# EAGLE design quadcopter (EAGLE 8.2.0)
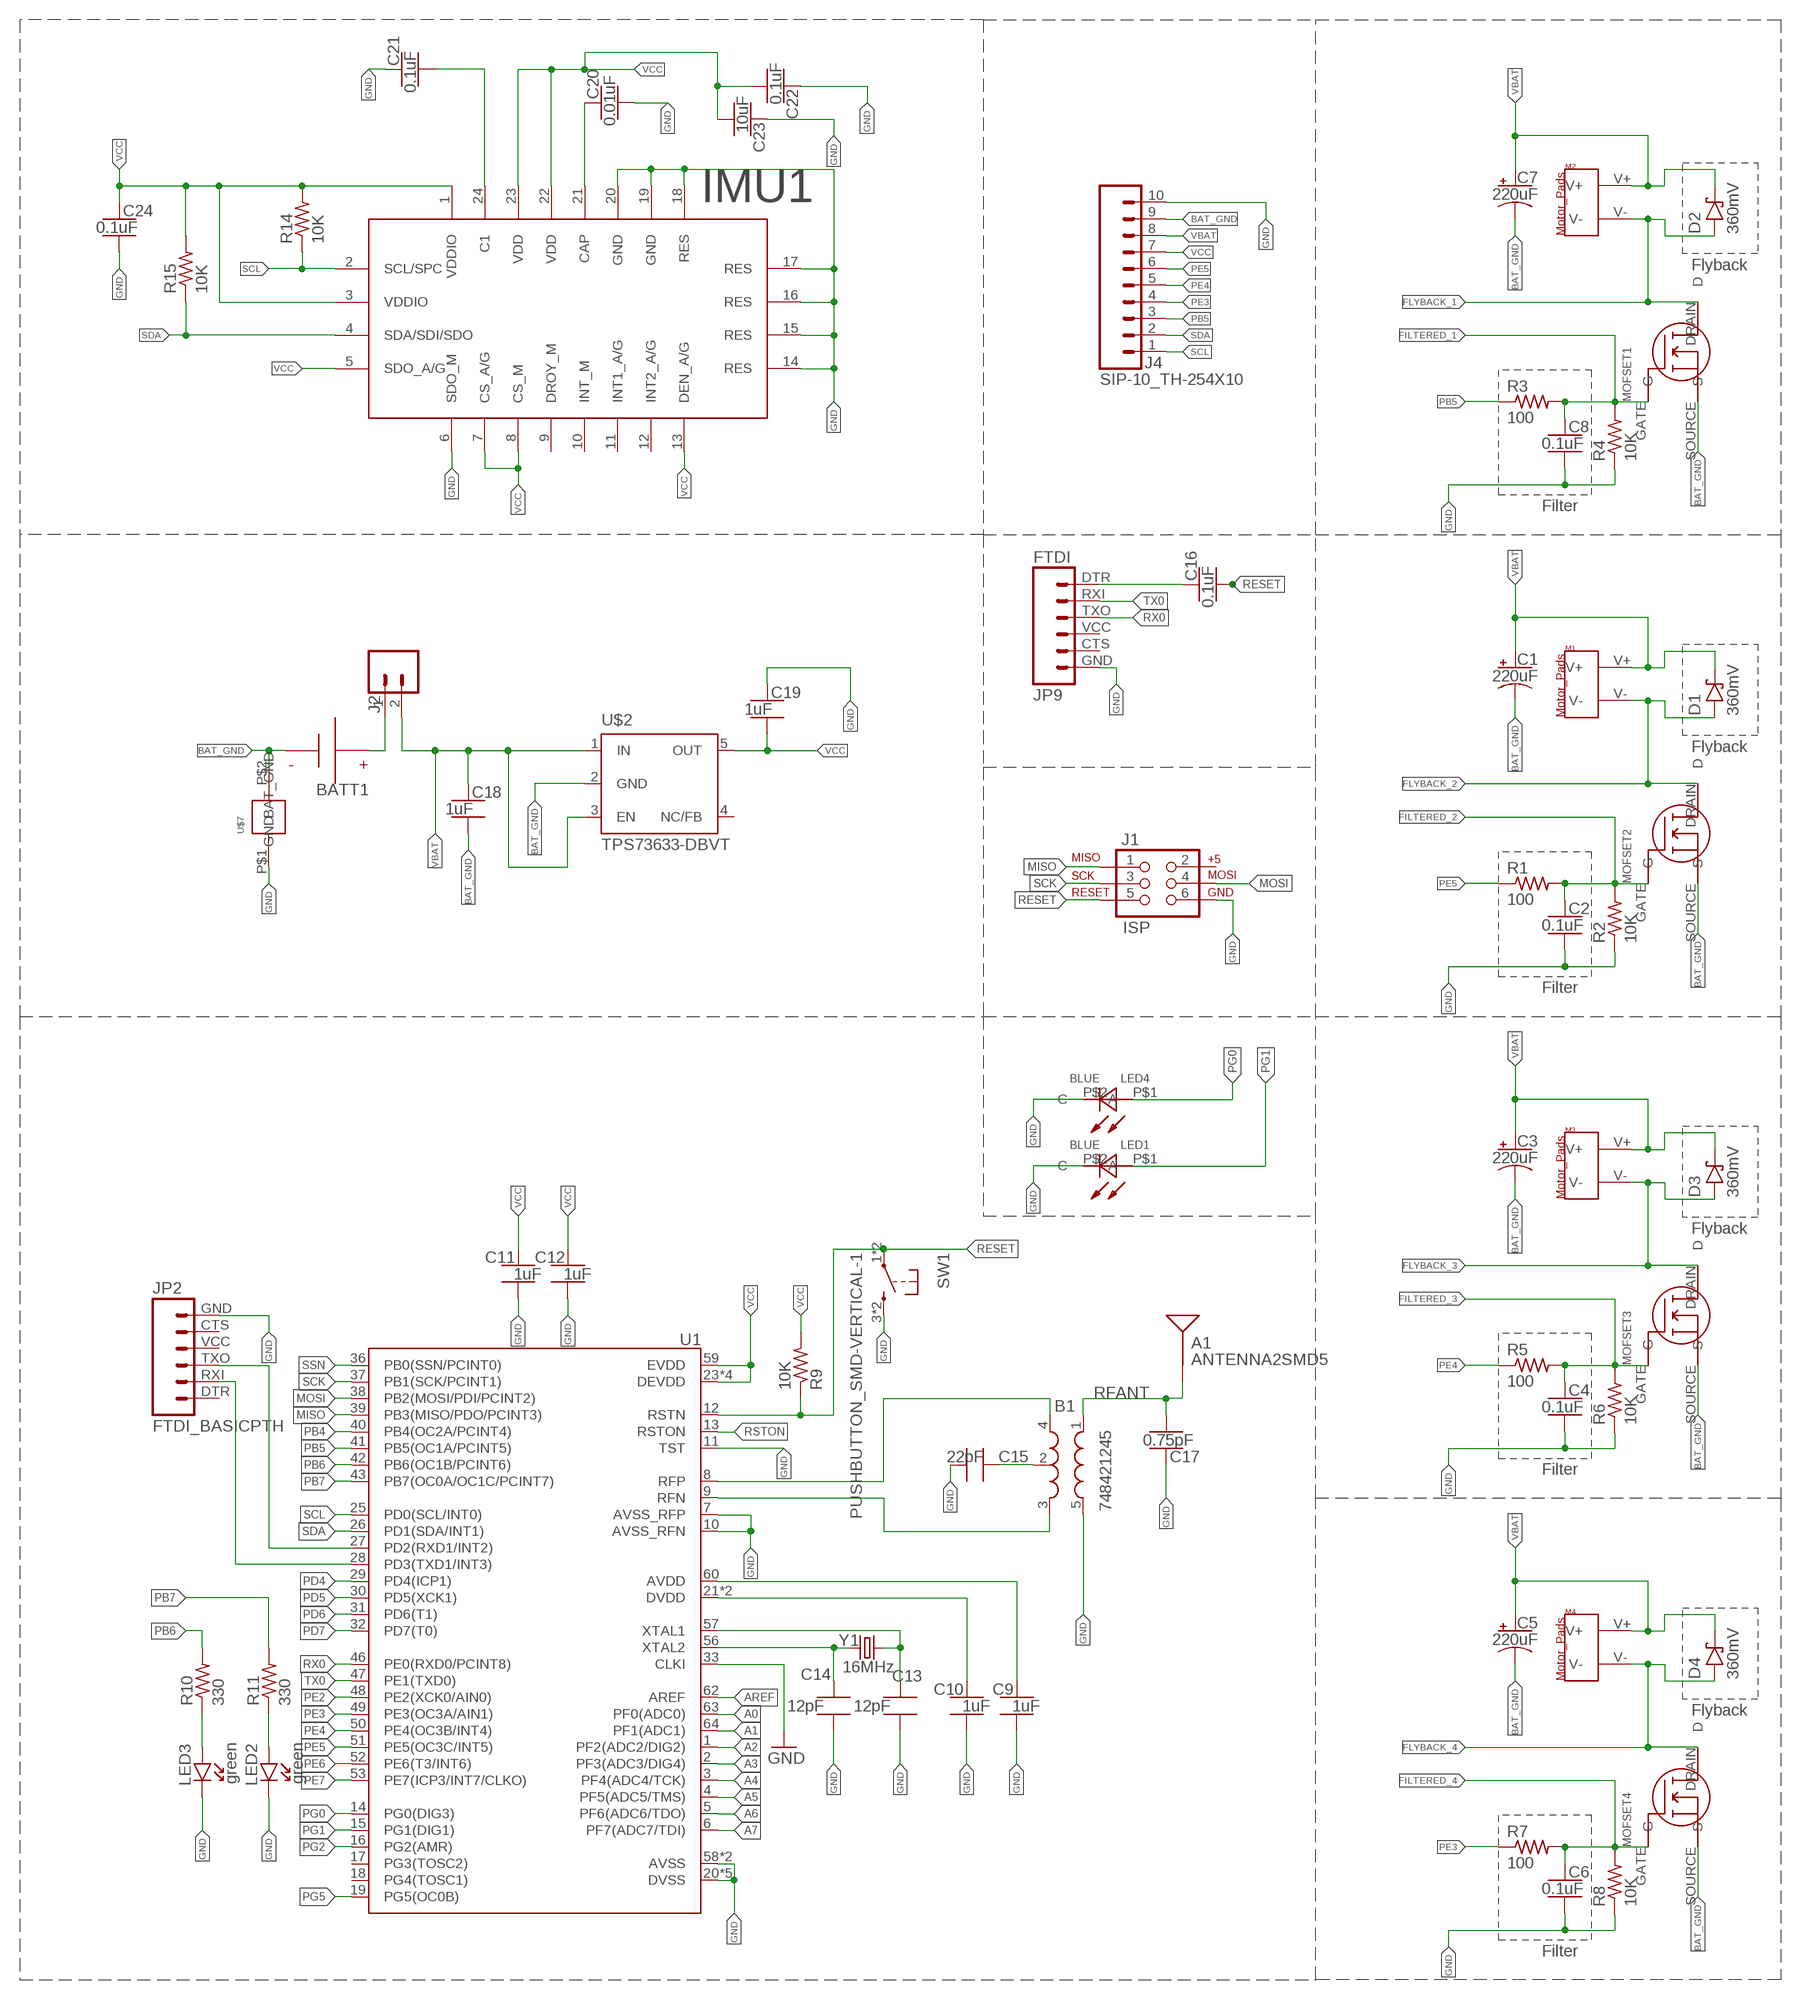
[diagram p0: schematic, sheet 1]

## Parts
A1  ANTENNA2SMD5  [ANTENNA-CHIP5]
B1  748421245  BALUN0805  [BALUN]
BATT1  BATTERY-HUBSAN-W/HOLDER  [BATTERY-W/HOLDER-380MAH-HUBSAN]
C1  220uF  CAPACITOR-POL_SMD-7043-D_TANTALUM-220UF  [CAPMP7343X310_HS]
C2  0.1uF  CAPACITOR-NP_SMD-2012-0805_CERAMIC-0.1UF  [CAPC2012X140_HS]
C3  220uF  CAPACITOR-POL_SMD-7043-D_TANTALUM-220UF  [CAPMP7343X310_HS]
C4  0.1uF  CAPACITOR-NP_SMD-2012-0805_CERAMIC-0.1UF  [CAPC2012X140_HS]
C5  220uF  CAPACITOR-POL_SMD-7043-D_TANTALUM-220UF  [CAPMP7343X310_HS]
C6  0.1uF  CAPACITOR-NP_SMD-2012-0805_CERAMIC-0.1UF  [CAPC2012X140_HS]
C7  220uF  CAPACITOR-POL_SMD-7043-D_TANTALUM-220UF  [CAPMP7343X310_HS]
C8  0.1uF  CAPACITOR-NP_SMD-2012-0805_CERAMIC-0.1UF  [CAPC2012X140_HS]
C9  1uF  CAPACITOR-NP_SMD-2012-0805_CERAMIC-1UF  [CAPC2012X140_HS]
C10  1uF  CAPACITOR-NP_SMD-2012-0805_CERAMIC-1UF  [CAPC2012X140_HS]
C11  1uF  CAPACITOR-NP_SMD-2012-0805_CERAMIC-1UF  [CAPC2012X140_HS]
C12  1uF  CAPACITOR-NP_SMD-2012-0805_CERAMIC-1UF  [CAPC2012X140_HS]
C13  12pF  CAPACITOR-NP_SMD-2012-0805_CERAMIC-12PF  [CAPC2012X140_HS]
C14  12pF  CAPACITOR-NP_SMD-2012-0805_CERAMIC-12PF  [CAPC2012X140_HS]
C15  22pF  CAPACITOR-NP_SMD-2012-0805_CERAMIC-22PF  [CAPC2012X140_HS]
C16  0.1uF  CAPACITOR-NP_SMD-2012-0805_CERAMIC-0.1UF  [CAPC2012X140_HS]
C17  0.75pF  CAPACITOR-NP_SMD-2012-0805_CERAMIC-0.75PF  [CAPC2012X140_HS]
C18  1uF  CAPACITOR-NP_SMD-2012-0805_CERAMIC-1UF  [CAPC2012X140_HS]
C19  1uF  CAPACITOR-NP_SMD-2012-0805_CERAMIC-1UF  [CAPC2012X140_HS]
C20  0.01uF  CAPACITOR-NP_SMD-2012-0805_CERAMIC-0.01UF  [CAPC2012X140_HS]
C21  0.1uF  CAPACITOR-NP_SMD-2012-0805_CERAMIC-0.1UF  [CAPC2012X140_HS]
C22  0.1uF  CAPACITOR-NP_SMD-2012-0805_CERAMIC-0.1UF  [CAPC2012X140_HS]
C23  10uF  CAPACITOR-NP_SMD-2012-0805_CERAMIC-10UF  [CAPC2012X140_HS]
C24  0.1uF  CAPACITOR-NP_SMD-2012-0805_CERAMIC-0.1UF  [CAPC2012X140_HS]
D1  360mV  DIODE-SCHOTTKY_SMD-SOD123-360MV  [SOD3716X135_HS]
D2  360mV  DIODE-SCHOTTKY_SMD-SOD123-360MV  [SOD3716X135_HS]
D3  360mV  DIODE-SCHOTTKY_SMD-SOD123-360MV  [SOD3716X135_HS]
D4  360mV  DIODE-SCHOTTKY_SMD-SOD123-360MV  [SOD3716X135_HS]
IMU1  9_AXIS_IMU  [9_AXIS_IMU]
J1  ISP  AVR_SPI_PRG_6NS  [2X3-NS]
J2  MALE_HEADER_2POS-2X1-0.1IN  [MALE_HEADER_2X1_0.1IN]
J4  SIP-10_TH-254X10  [HDRV10W63P254_10X1_2540X254H838_HS]
JP2  FTDI_BASICPTH  [FTDI_BASIC]
JP9  FTDI  FTDI_BASICPTH  [FTDI_BASIC]
LED1  BLUE  LTST-C193TBKT-5ADISCRETE_LED  [CUT_TAPE]
LED2  green  DIODE-LED_SMD-2012-0805-GREEN  [LEDSC125X200X120-2_HS]
LED3  green  DIODE-LED_SMD-2012-0805-GREEN  [LEDSC125X200X120-2_HS]
LED4  BLUE  LTST-C193TBKT-5ADISCRETE_LED  [CUT_TAPE]
M1  MOTOR_PADS  [MOTOR_PADS]
M2  MOTOR_PADS  [MOTOR_PADS]
M3  MOTOR_PADS  [MOTOR_PADS]
M4  MOTOR_PADS  [MOTOR_PADS]
MOFSET1  SI2302CDS_N_MOFSETSI2302CDS  [N-CHANNEL_MOSFET]
MOFSET2  SI2302CDS_N_MOFSETSI2302CDS  [N-CHANNEL_MOSFET]
MOFSET3  SI2302CDS_N_MOFSETSI2302CDS  [N-CHANNEL_MOSFET]
MOFSET4  SI2302CDS_N_MOFSETSI2302CDS  [N-CHANNEL_MOSFET]
R1  100  RESISTOR_SMD-2012-0805-100  [RESC2012X60_HS]
R2  10K  RESISTOR_SMD-2012-0805-10K  [RESC2012X60_HS]
R3  100  RESISTOR_SMD-2012-0805-100  [RESC2012X60_HS]
R4  10K  RESISTOR_SMD-2012-0805-10K  [RESC2012X60_HS]
R5  100  RESISTOR_SMD-2012-0805-100  [RESC2012X60_HS]
R6  10K  RESISTOR_SMD-2012-0805-10K  [RESC2012X60_HS]
R7  100  RESISTOR_SMD-2012-0805-100  [RESC2012X60_HS]
R8  10K  RESISTOR_SMD-2012-0805-10K  [RESC2012X60_HS]
R9  10K  RESISTOR_SMD-2012-0805-10K  [RESC2012X60_HS]
R10  330  RESISTOR_SMD-2012-0805-330  [RESC2012X60_HS]
R11  330  RESISTOR_SMD-2012-0805-330  [RESC2012X60_HS]
R14  10K  RESISTOR_SMD-2012-0805-10K  [RESC2012X60_HS]
R15  10K  RESISTOR_SMD-2012-0805-10K  [RESC2012X60_HS]
SW1  PUSHBUTTON_SMD-VERTICAL-1  [TE_FSM8JSMA_HS]
U1  ATMEGA128RFA1  [QFN-64]
U$2  TPS73633-DBVT  [SOT23-DBV]
U$7  NET_BRIDGE  [NET_BRIDGE]
Y1  16MHz  CRYSTAL5X3  [CRYSTAL-SMD-5X3]

## Nets
A0: U1.63(PF0(ADC0))
A1: U1.64(PF1(ADC1))
A2: U1.1(PF2(ADC2/DIG2))
A3: U1.2(PF3(ADC3/DIG4))
A4: U1.3(PF4(ADC4/TCK))
A5: U1.4(PF5(ADC5/TMS))
A6: U1.5(PF6(ADC6/TDO))
A7: U1.6(PF7(ADC7/TDI))
AREF: U1.62(AREF)
AVDD: C9.1 U1.60(AVDD)
BAT_GND [HIGHCURRENT]: BATT1.-(N) C1.2(-) C3.2(-) C5.2(-) C7.2(-) C18.2 J4.9 MOFSET1.SOURCE(S) MOFSET2.SOURCE(S) MOFSET3.SOURCE(S) MOFSET4.SOURCE(S) U$2.2(GND) U$7.P$2(GND)
DTR: C16.1 JP9.DTR
DVDD: C10.1 U1.21(DVDD) U1.22(DVDD)
FILTERED_1 [HIGHCURRENT]: C8.1 MOFSET1.GATE(G) R3.2 R4.2
FILTERED_2 [HIGHCURRENT]: C2.1 MOFSET2.GATE(G) R1.2 R2.2
FILTERED_3 [HIGHCURRENT]: C4.1 MOFSET3.GATE(G) R5.2 R6.2
FILTERED_4 [HIGHCURRENT]: C6.1 MOFSET4.GATE(G) R7.2 R8.2
FLYBACK_1 [HIGHCURRENT]: D2.A M2.V- MOFSET1.DRAIN(D)
FLYBACK_2 [HIGHCURRENT]: D1.A M1.V- MOFSET2.DRAIN(D)
FLYBACK_3 [HIGHCURRENT]: D3.A M3.V- MOFSET3.DRAIN(D)
FLYBACK_4 [HIGHCURRENT]: D4.A M4.V- MOFSET4.DRAIN(D)
GND: B1.5(GND) C2.2 C4.2 C6.2 C8.2 C9.2 C10.2 C11.2 C12.2 C13.2 C14.2 C15.2 C17.1 C19.1 C20.2 C21.1 C22.1 C23.1 C24.2 IMU1.6(SDO_M) IMU1.14(RES) IMU1.15(RES) IMU1.16(RES) IMU1.17(RES) IMU1.18(RES) IMU1.19(GND) IMU1.20(GND) J1.6 J4.10 JP2.GND JP9.GND LED1.P$2(C) LED2.C LED3.C LED4.P$2(C) R2.1 R4.1 R6.1 R8.1 SW1.3 SW1.4 U1.7(AVSS_RFP) U1.10(AVSS_RFN) U1.11(TST) U1.20(DVSS) U1.24(DVSS) U1.33(CLKI) U1.35(DVSS) U1.45(DVSS) U1.55(DVSS) U1.58(AVSS) U1.61(AVSS) U$7.P$1(BAT_GND)
MISO: J1.1 U1.39(PB3(MISO/PDO/PCINT3))
MOSI: J1.4 U1.38(PB2(MOSI/PDI/PCINT2))
N$1: C20.1 IMU1.21(CAP)
N$2: C21.2 IMU1.24(C1)
N$4: JP2.RXI U1.28(PD3(TXD1/INT3))
N$5: JP2.TXO U1.27(PD2(RXD1/INT2))
N$7 [HIGHCURRENT]: BATT1.+(P) J2.1
N$13: C13.1 U1.57(XTAL1) Y1.3
N$14: C14.1 U1.56(XTAL2) Y1.1
N$15: B1.2(GND) C15.1
N$16: LED3.A R10.1
N$17: LED2.A R11.1
N$18: B1.4(OUT1) U1.8(RFP)
N$19: B1.3(OUT2) U1.9(RFN)
PB4: U1.40(PB4(OC2A/PCINT4))
PB5: J4.3 R3.1 U1.41(PB5(OC1A/PCINT5))
PB6: R10.2 U1.42(PB6(OC1B/PCINT6))
PB7: R11.2 U1.43(PB7(OC0A/OC1C/PCINT7))
PD4: U1.29(PD4(ICP1))
PD5: U1.30(PD5(XCK1))
PD6: U1.31(PD6(T1))
PD7: U1.32(PD7(T0))
PE2: U1.48(PE2(XCK0/AIN0))
PE3: J4.4 R7.1 U1.49(PE3(OC3A/AIN1))
PE4: J4.5 R5.1 U1.50(PE4(OC3B/INT4))
PE5: J4.6 R1.1 U1.51(PE5(OC3C/INT5))
PE6: U1.52(PE6(T3/INT6))
PE7: U1.53(PE7(ICP3/INT7/CLKO))
PG0: LED4.P$1(A) U1.14(PG0(DIG3))
PG1: LED1.P$1(A) U1.15(PG1(DIG1))
PG2: U1.16(PG2(AMR))
PG5: U1.19(PG5(OC0B))
RESET: C16.2 J1.5 R9.1 SW1.1 SW1.2 U1.12(RSTN)
RFANT [RFSIG]: A1.FEED(SIGNAL) B1.1(IN) C17.2
RSTON: U1.13(RSTON)
RX0: JP9.TXO U1.46(PE0(RXD0/PCINT8))
SCK: J1.3 U1.37(PB1(SCK/PCINT1))
SCL: IMU1.2(SCL/SPC) J4.1 R14.1 U1.25(PD0(SCL/INT0))
SDA: IMU1.4(SDA/SDI/SDO) J4.2 R15.1 U1.26(PD1(SDA/INT1))
SSN: U1.36(PB0(SSN/PCINT0))
TX0: JP9.RXI U1.47(PE1(TXD0))
VBAT [HIGHCURRENT]: C1.1(+) C3.1(+) C5.1(+) C7.1(+) C18.1 D1.C D2.C D3.C D4.C J2.2 J4.8 M1.V+ M2.V+ M3.V+ M4.V+ U$2.1(IN) U$2.3(EN)
VCC: C11.1 C12.1 C19.2 C22.2 C23.2 C24.1 IMU1.1(VDDIO) IMU1.3(VDDIO) IMU1.5(SDO_A/G) IMU1.7(CS_A/G) IMU1.8(CS_M) IMU1.13(DEN_A/G) IMU1.22(VDD) IMU1.23(VDD) J4.7 R9.2 R14.2 R15.2 U1.23(DEVDD) U1.34(DEVDD) U1.44(DEVDD) U1.54(DEVDD) U1.59(EVDD) U$2.5(OUT)
Unconnected: IMU1.9(DROY_M) IMU1.10(INT_M) IMU1.11(INT1_A/G) IMU1.12(INT2_A/G) J1.2 JP2.CTS JP2.DTR JP2.VCC JP9.CTS JP9.VCC U1.17(PG3(TOSC2)) U1.18(PG4(TOSC1)) U$2.4(NC/FB)

## Notes on the sheet
- Flyback
- Filter
- Flyback
- Filter
- Flyback
- Filter
- Flyback
- Filter

## Library data of the parts
A1 = quadparts_prebuilt:ANTENNA2: Chip antenna Single endded antenna. Common with smaller chip antennas. CHIP4 package is the GPS Chip Antenna SKU: GPS-08418. CHIP5 package is 2.4GHz chip antenna SKU: WRL-00144.; DATASHEET: http://www.linxtechnologies.com/resources/data-guides/ant-xxx-chp-x.pdf; DIST: Digikey; DISTPN: ANT-2.45-CHPCT-ND; MFR: Linx Technologies Inc.; MPN: ANT-2.45-CHP-T; PRICE: 3.16
B1 = quadparts_prebuilt:BALUN: 0805 footprint balun- Ember 351/357; CREATOR: PROF; DATASHEET: http://katalog.we-online.de/pbs/datasheet/748421245.pdf; DIST: Digikey; DISTPN: 732-2230-6-ND; MFR: Wurth Electronics Inc; MPN: 748421245; PRICE: 2.63
BATT1 = quadparts_prebuilt:BATTERY; CREATOR: Swanson; DIST: AMAZON; DISTPN: http://www.amazon.com/dp/B00RROB6Q4?smid=AMNTPWSAB5H0S; MFR: HUBSAN; MPN: X4-H107C-8-in-1
C1 C3 C5 C7 = quadparts_prebuilt:CAPACITOR-POL_: Polarized capacitor; DIST: Digikey; DISTPN: 478-8912-1-ND; MFR: AVX Corporation; MPN: TAJD227K006RNJ
C2 C4 C6 C8 C16 C21 C22 C24 = quadparts_prebuilt:CAPACITOR-NP_: Nonpolarized capacitor; CREATOR: PROF; DIST: Digikey; DISTPN: 490-1666-1-ND; MFR: Murata Electronics North America; MPN: GRM21BR71H104KA01L
C9-C12 C18 C19 = quadparts_prebuilt:CAPACITOR-NP_: Nonpolarized capacitor; DIST: Digikey; DISTPN: 490-4736-1-ND; MFR: Murata Electronics North America; MPN: GRM21BR71H105KA12L
C13 C14 = quadparts_prebuilt:CAPACITOR-NP_: Nonpolarized capacitor; DIST: Digikey; DISTPN: 490-5531-1-ND; MFR: Murata Electronics North America; MPN: GRM21A5C2E120JW01D
C15 = quadparts_prebuilt:CAPACITOR-NP_: Nonpolarized capacitor; CREATOR: PROF; DIST: Digikey; DISTPN: 490-5534-1-ND; MFR: Murata Electronics North America; MPN: GRM21A5C2E220JW01D
C17 = quadparts_prebuilt:CAPACITOR-NP_: Nonpolarized capacitor; DIST: Digikey; DISTPN: 490-3585-1-ND; MFR: Murata Electronics North America; MPN: GQM2195C2AR75CB01D
C20 = quadparts_prebuilt:CAPACITOR-NP_: Nonpolarized capacitor; CREATOR: PROF; DIST: Digikey; DISTPN: 490-8295-1-ND; MFR: Murata Electronics North America; MPN: GRM2195C1H103FA01D
C23 = quadparts_prebuilt:CAPACITOR-NP_: Nonpolarized capacitor; DIST: Digikey; DISTPN: 490-5523-1-ND; MFR: Murata Electronics North America; MPN: GRM21BR61E106KA73L
D1-D4 = quadparts_prebuilt:DIODE-SCHOTTKY_: Schottky diode; DIST: Digikey; DISTPN: CRS08QMCT-ND; MFR: Toshiba Semiconductor and Storage; MPN: CRS08(TE85L,Q,M)
IMU1 = quadparts_yupei:9_AXIS_IMU; CREATOR: Yupei; DIST: Digikey; DISTPN: 497-14946-1-ND; MFR: STMicroelectronics; MPN: LSM9DS1TR; REVIEWER: Group 9
J1 = quadparts_prebuilt:AVR_SPI_PRG_6: AVR ISP 6 Pin This is the reduced ISP connector for AVR programming. Common on Arduino. This footprint will take up less PCB space and can be used with a 10-pin to 6-pin adapter such as SKU: BOB-08508; CREATOR: PROF; DATASHEET: http://portal.fciconnect.com/Comergent//fci/drawing/67996.pdf; DIST: Digikey; DISTPN: 609-3234-ND; MFR: Amphenol FCI; MPN: 67997-206HLF; PRICE: 0.31
J2 = quadparts:MALE_HEADER_2POS: 2 pin single inline pin header, socket, or connector; CREATOR: SWANSON; DIST: Digikey; DISTPN: 3M9447-ND; MFR: 3M; MPN: 961102-6404-AR; REVIEWER: Group 9
J4 = quadparts_prebuilt:SIP-10_: 10 pin single inline pin header, socket, or connector; DATASHEET: http://portal.fciconnect.com/Comergent//fci/drawing/68000.pdf; DIST: Digikey; DISTPN: 609-3250-ND; MFR: Amphenol FCI; MPN: 68000-110HLF; PRICE: 0.55
JP2 JP9 = quadparts_prebuilt:FTDI_BASIC: FTDI Basic header with labels; DATASHEET: http://portal.fciconnect.com/Comergent//fci/drawing/68015.pdf; DIST: Digikey; DISTPN: 609-3327-ND; MFR: Amphenol FCI; MPN: 68016-406HLF; PRICE: 0.33
LED1 LED4 = LEDs:LTST-C193TBKT-5A: Discrete LED indication with blue color.; CREATOR: Yueqi Wang; DIST: Digikey; DISTPN: 160-1827-1-ND; MFR: Lite-On Inc; MPN: LTST-C193TBKT-5A; REVIEWER: Group 9
LED2 LED3 = quadparts_prebuilt:DIODE-LED_: Light emitting diode; DIST: Digikey; DISTPN: 160-1179-1-ND; MFR: Lite-On Inc; MPN: LTST-C170GKT
M1-M4 = quadparts_prebuilt:MOTOR_PADS; CREATOR: PROF; DIST: NA; DISTPN: NA; MFR: NA; MPN: NA
MOFSET1-MOFSET4 = quadparts:SI2302CDS_N_MOFSET: N-Channel 20 V (D-S) MOSFET Si2302CDS by Vishay Siliconix. Features: 1. TrenchFET Power MOSFET. 2. Material categorization: For definitions of compliance please see www.vishay.com/doc?99912 Applications: 1. Load Switching for Portable Devices 2. DC/AC Converter; CREATOR: YUEQI WANG; DIST: Digikey; DISTPN: SI2302CDS-T1-E3CT-ND; MFR: Vishay Siliconix; MPN: SI2302CDS-T1-E3; REVIEWER: Group 9
R1 R3 R5 R7 = quadparts_prebuilt:RESISTOR_: Resistor; CREATOR: PROF; DIST: Digikey; DISTPN: 311-100ARCT-ND; MFR: Yageo; MPN: RC0805JR-07100RL
R2 R4 R6 R8 R9 R14 R15 = quadparts_prebuilt:RESISTOR_: Resistor; CREATOR: PROF; DIST: Digikey; DISTPN: 311-10KARCT-ND; MFR: Yageo; MPN: RC0805JR-0710KL
R10 R11 = quadparts_prebuilt:RESISTOR_: Resistor; CREATOR: PROF; DIST: Digikey; DISTPN: 311-330ARCT-ND; MFR: Yageo; MPN: RC0805JR-07330RL
SW1 = quadparts_prebuilt:PUSHBUTTON_: Pushbutton with 2 pins shorting 1 to 2 and two extra mounting pins 3 & 4; DIST: Digikey; DISTPN: 450-1129-ND; MFR: TE Connectivity Alcoswitch Switches; MPN: FSM4JSMA
U1 = quadparts_prebuilt:ATMEGA128RFA1: ATmega128RFA1 8-bit AVR Microcontroller with Low Power 2.4GHz Transceiver for ZigBee and IEEE 802.15.4; CREATOR: Swanson; DATASHEET: http://www.atmel.com/Images/Atmel-8266-MCU_Wireless-ATmega128RFA1_Datasheet.pdf; DIST: Digikey; DISTPN: ATMEGA128RFA1-ZUR00DKR-ND; MFR: Atmel; MPN: ATMEGA128RFA1-ZUR00; PRICE: 10.21
U$2 = quadparts_prebuilt:TPS73633-DBVT; DATASHEET: http://www.ti.com/lit/ds/symlink/lp3985.pdf; DIST: Digikey; DISTPN: LP3985IM5X-3.0/NOPBCT-ND; MFR: Texas Instruments; MPN: LP3985IM5X-3.0/NOPB; PRICE: 0.59
U$7 = quadparts_prebuilt:NET_BRIDGE
Y1 = quadparts_prebuilt:CRYSTAL: Various standard crystals. Proven footprints.; DATASHEET: http://www.abracon.com/Resonators/abm3b.pdf; DIST: Digikey; DISTPN: 535-9122-1-ND; MFR: Abracon LLC; MPN: ABM3B-16.000MHZ-B2-T; PRICE: 0.68; PROD_ID: XTAL-08218

## Net classes
1 RFSIG: width 0.457 mm
2 HIGHCURRENT: width 0.457 mm

## Board
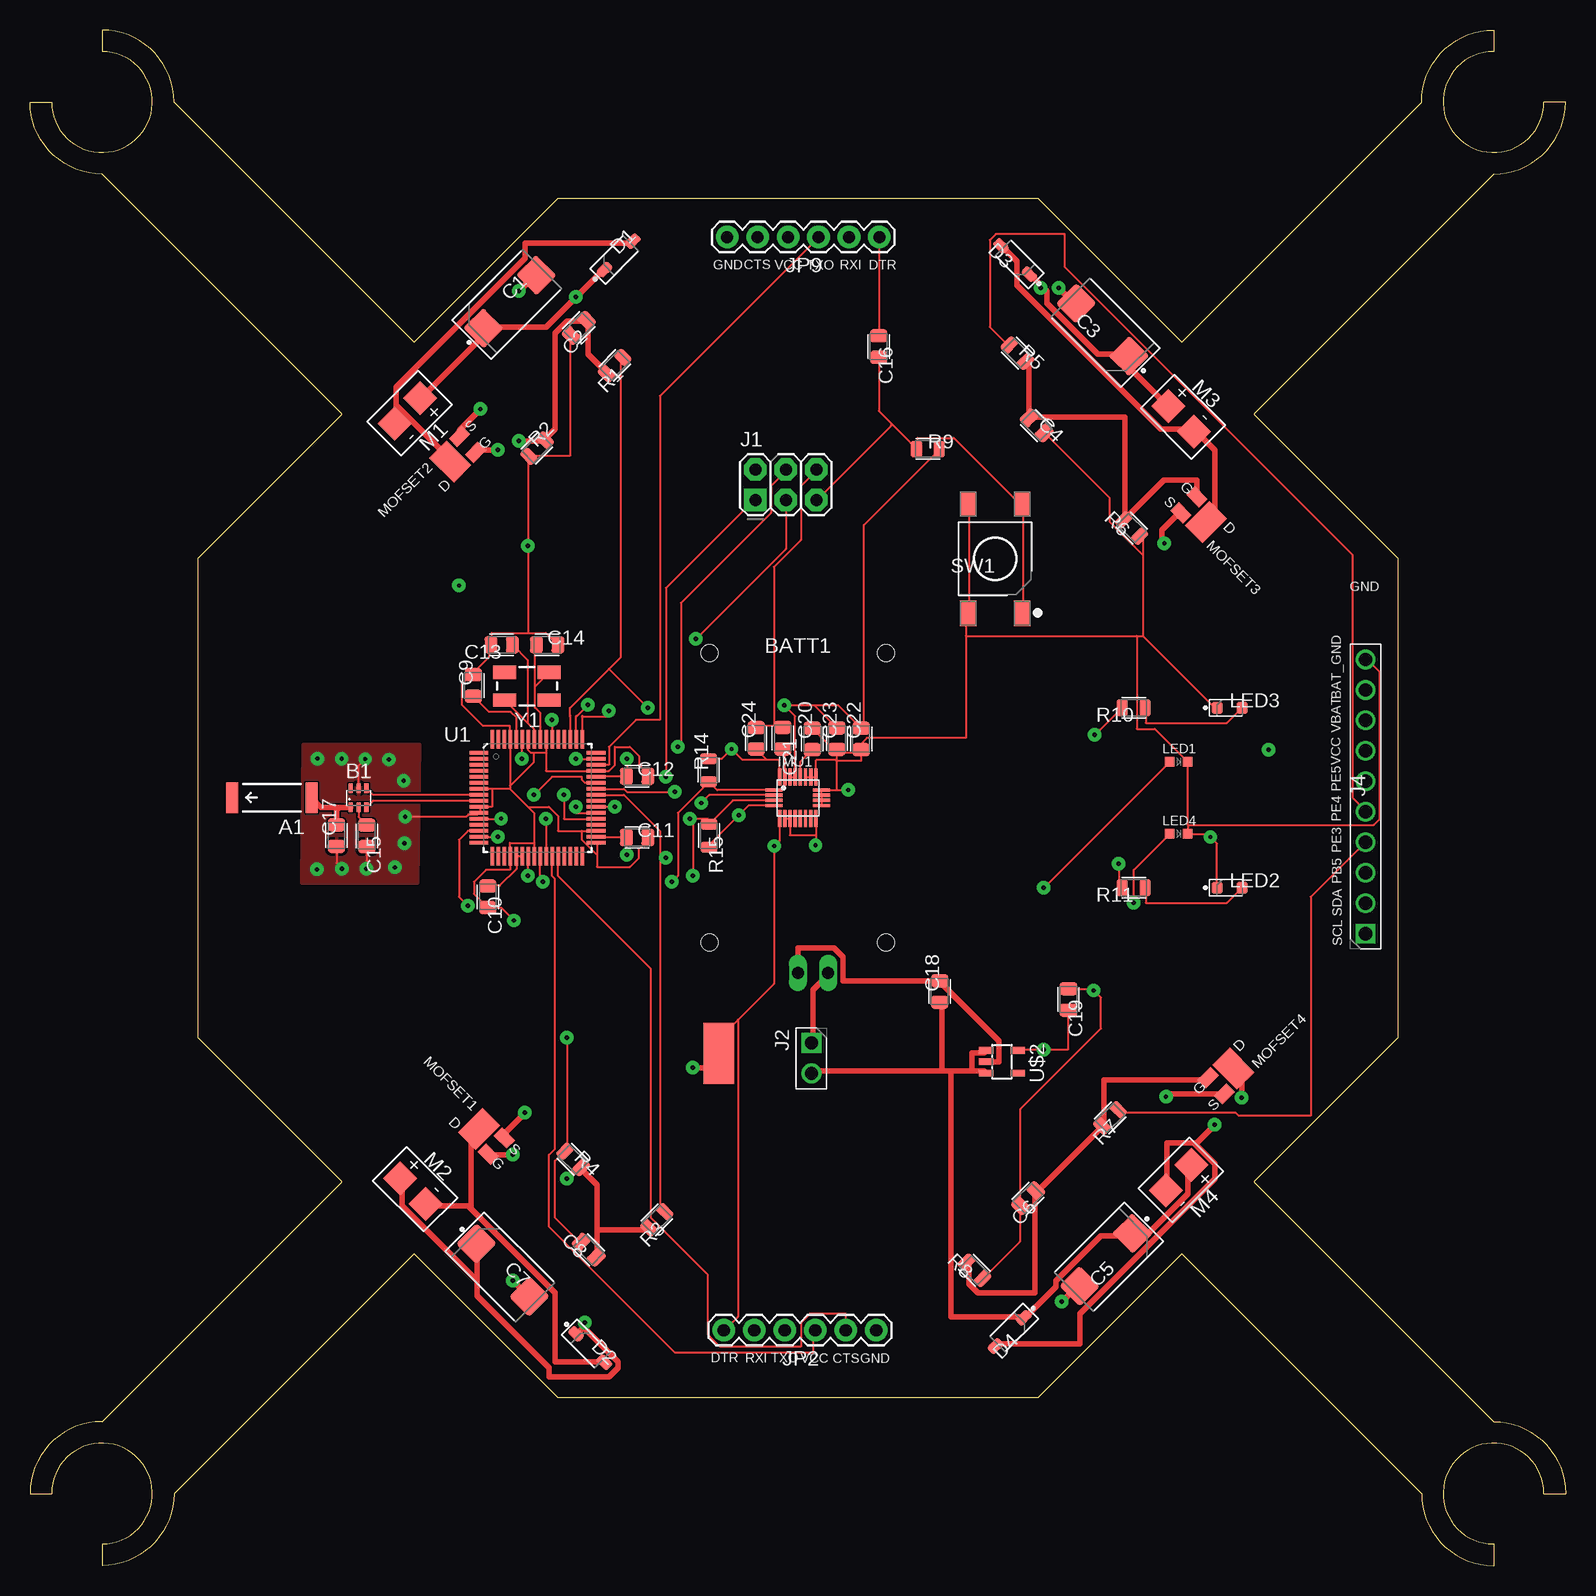
[diagram p1: board, top side]
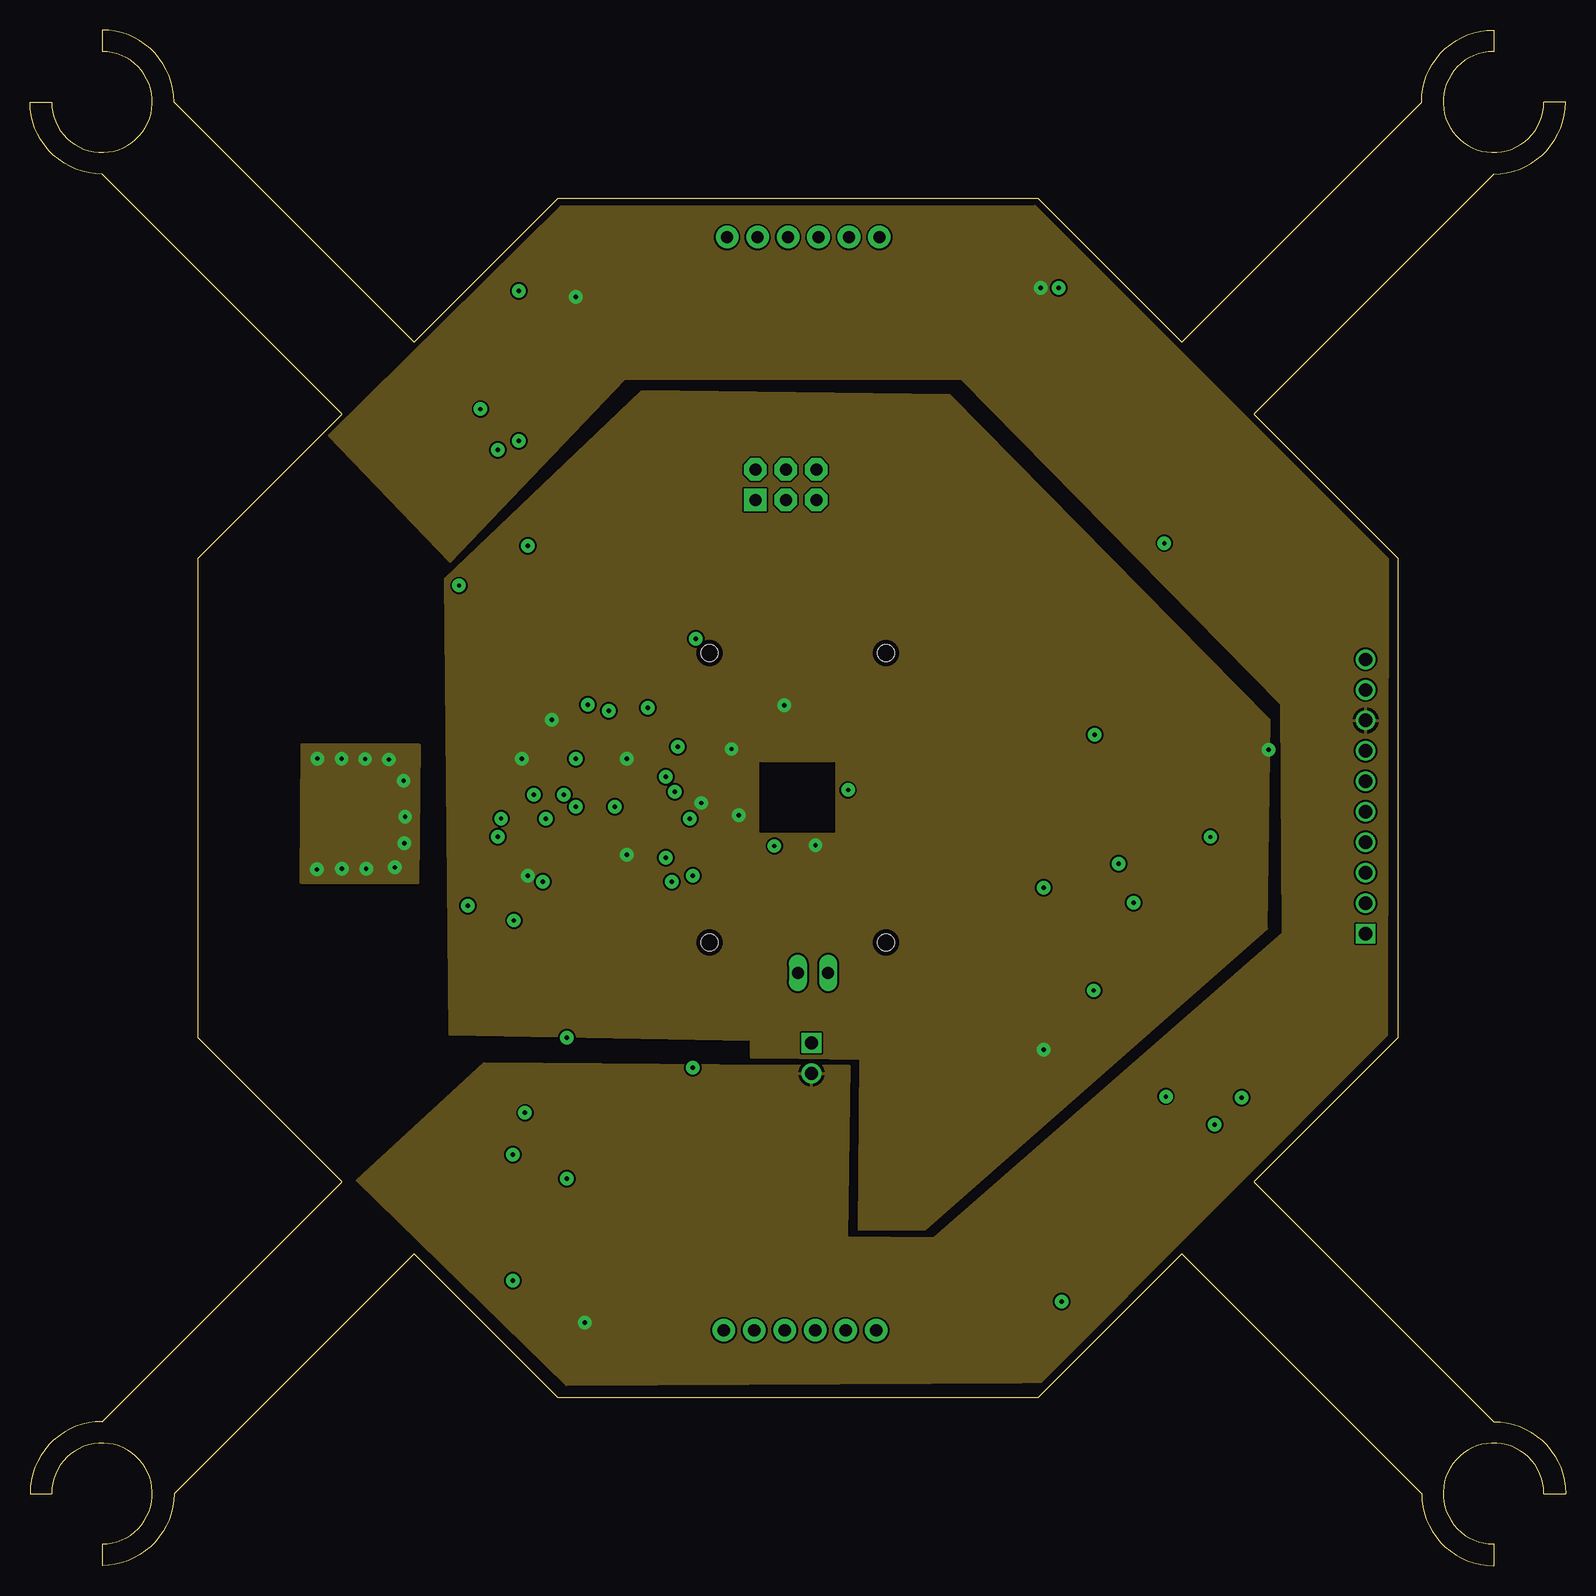
[diagram p2: board, inner layer Route2]
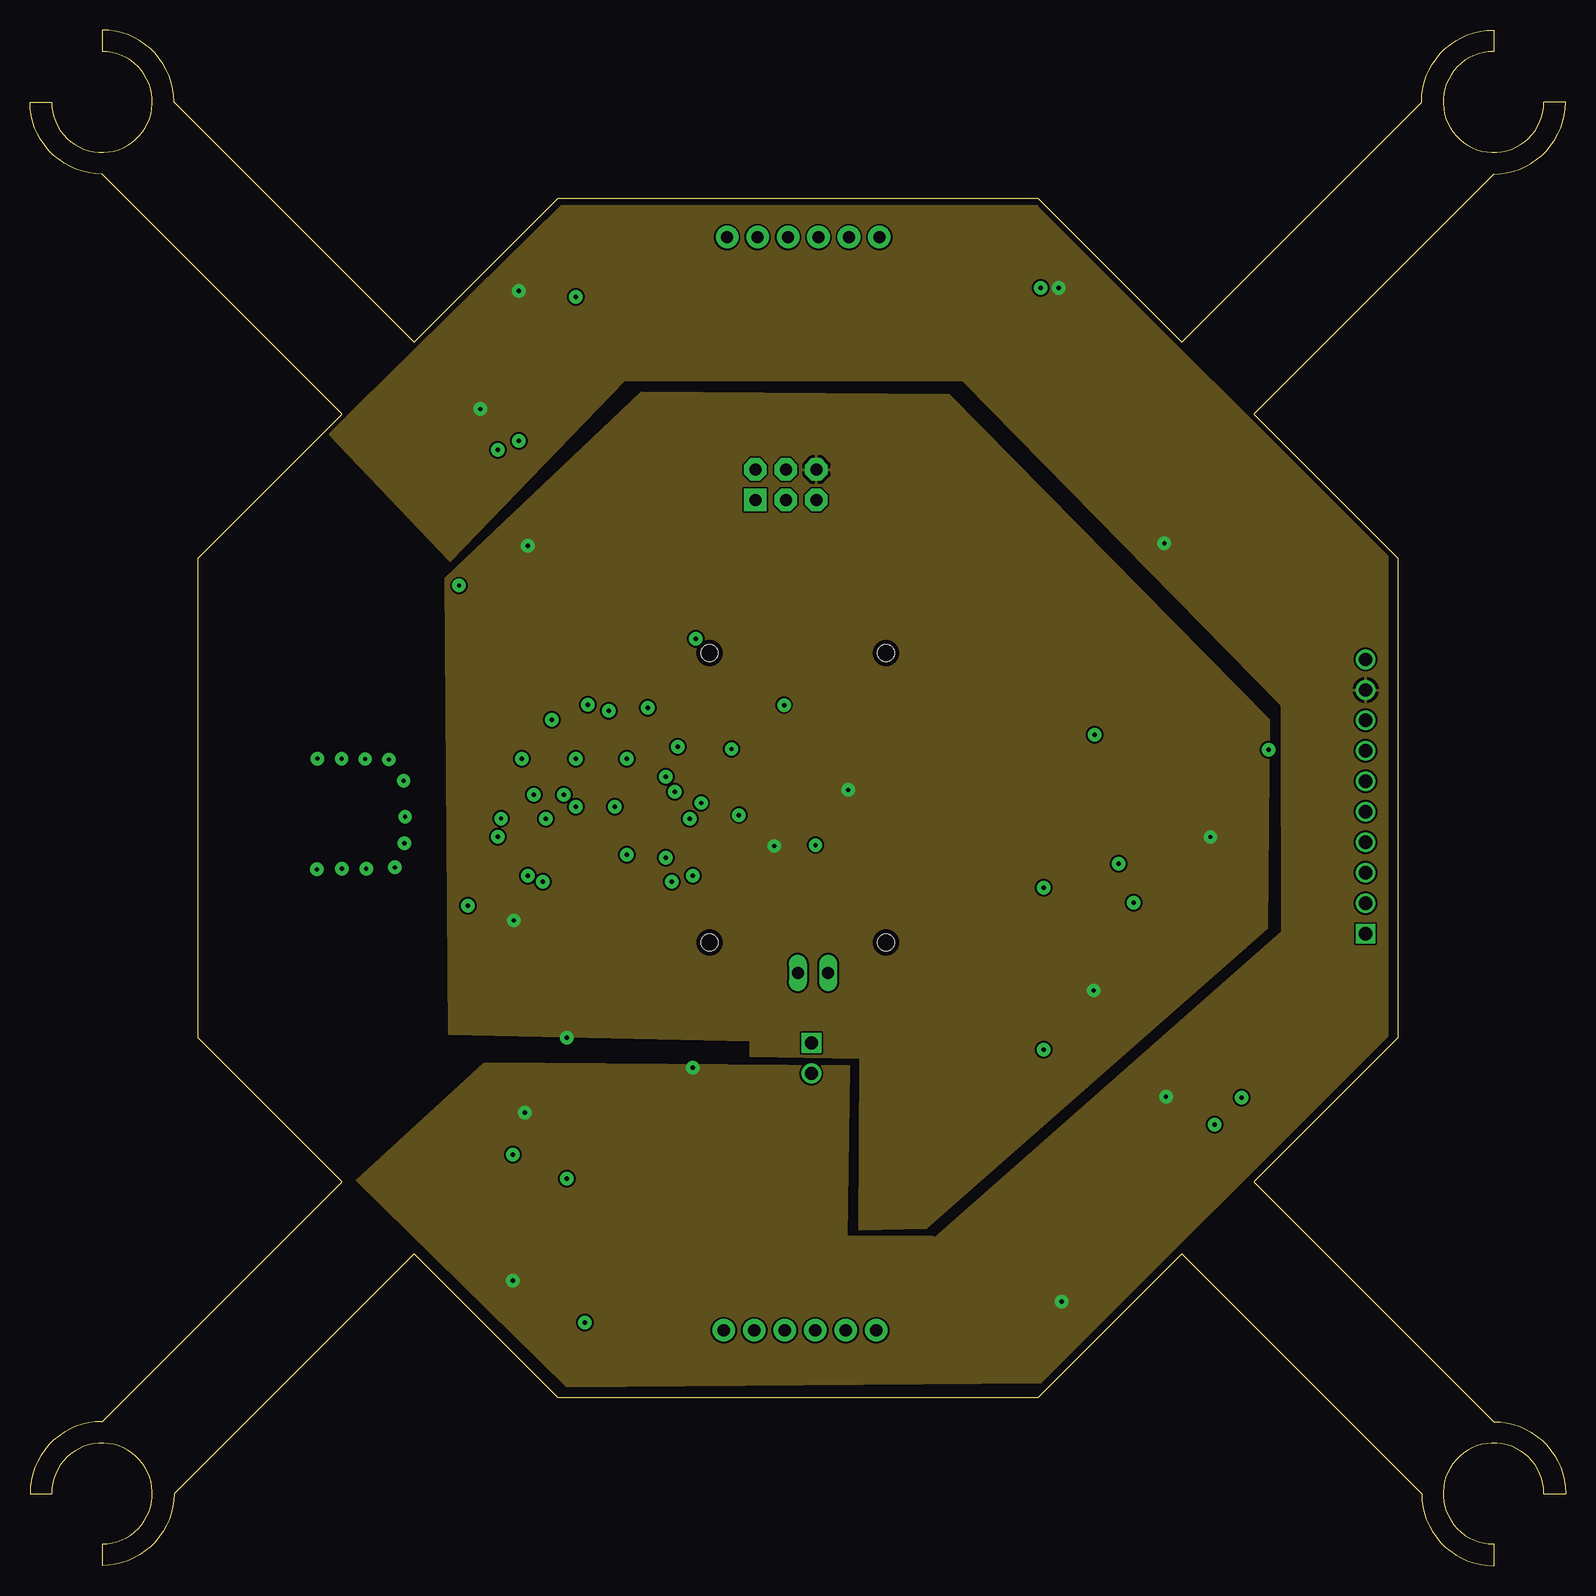
[diagram p3: board, inner layer Route15]
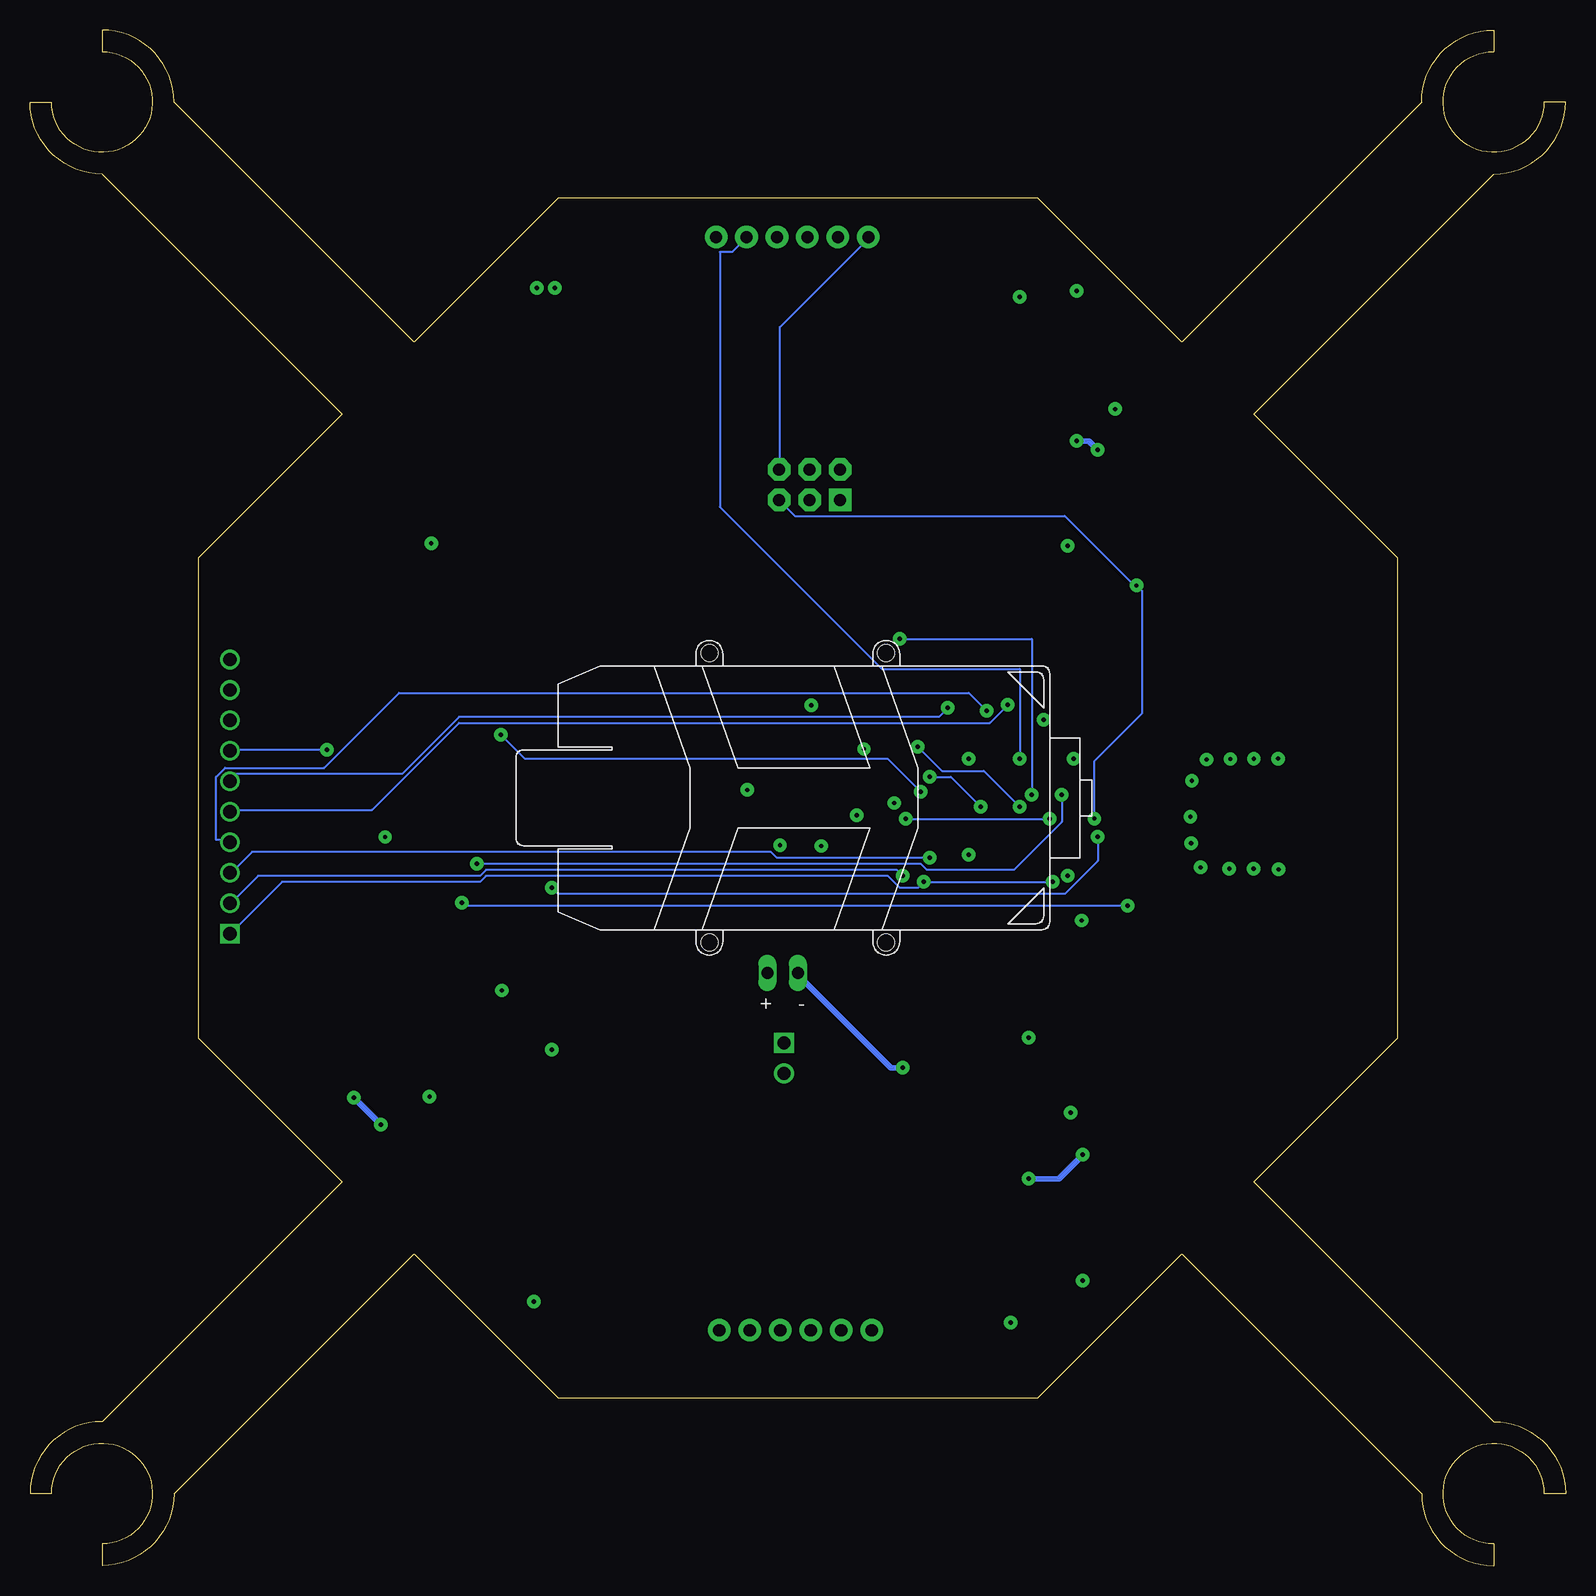
[diagram p4: board, bottom side, seen from below]

Size 128 x 128 mm. Coordinates in mm from the lower left corner, seen from the top.
Outline: 44,114 84,114 96,102 116,122 arc-90 122,128 122,126.2 arc270 126.2,122 128,122 arc-90 122,116 102,96 114,84 114,44 102,32 122,12 arc-90 128,6 126.2,6 arc270 122,1.8 122,0 arc-90 116,6 96,26 84,14 44,14 32,26 12,6 arc-90 6,0 6,1.8 arc270 1.8,6 0,6 arc-90 6,12 26,32 14,44 14,84 26,96 6,116 arc-90 0,122 1.8,122 arc270 6,126.2 6,128 arc-90 12,122 32,102 44,114
Copper layers (1*2*15*16): Top 0.035559375mm / dielectric 1.501140625mm / Route2 0.035559375mm / dielectric 0.149859375mm / Route15 0.035559375mm / dielectric 0.200659375mm / Bottom 0.035559375mm
Design rules "4pcb-66board": minimum track width 6mil, minimum drill 15mil, track to track 6mil, track to pad 6mil, pad to pad 6mil, via to via 6mil, smd to smd 6mil, copper to edge 15mil, drill to drill 10mil, minimum pad ring 10mil, minimum via ring 15mil, stop-mask expansion 4mil, vias tented up to drill 0mil, thermal gap 10mil
tRestrict: area 60.9,61.1 to 67,66.9; area 33.6,68.2 to 33.7,68.3
bRestrict: area 60.9,61.1 to 67.1,66.9

### Footprints (pad centres in the part's own frame; a part is rotated, then mirrored left to right if it is on the bottom)
ANTENNA-CHIP5 = smd 1.016 x 2.54: FEED -3.302,0; NC 3.302,0
BALUN = smd 0.35 x 0.8: 1 -0.65,-0.8; 2 0,-0.8; 3 0.65,-0.8; 4 0.65,0.8; 5 0,0.8; 6 -0.65,0.8
BATTERY-W/HOLDER-380MAH-HUBSAN = drill 1 long: + -2.54,14.605; - 0,14.605 | hole 1.4: -7.35,-12.05; -7.35,12.05; 7.35,-12.05; 7.35,12.05
CAPMP7343X310_HS = smd 2.37 x 2.43: 1 -3.12,0; 2 3.12,0
CAPC2012X140_HS = smd 1.08 x 1.42: 1 -0.895,0; 2 0.895,0
SOD3716X135_HS = smd 1.25 x 0.8: A 1.665,0; C -1.665,0
9_AXIS_IMU = smd 0.28 x 1.4: 1 -1.505,1.725; 6 -1.505,-1.725; 7 -1.075,-1.725; 8 -0.645,-1.725; 9 -0.215,-1.725; 10 0.215,-1.725; 11 0.645,-1.725; 12 1.075,-1.725; 13 1.505,-1.725; 18 1.515,1.725; 19 1.075,1.725; 20 0.645,1.725; 21 0.215,1.725; 22 -0.215,1.725; 23 -0.645,1.725; 24 -1.075,1.725 | smd 1.4 x 0.28: 2 -1.975,0.645; 3 -1.975,0.215; 4 -1.975,-0.215; 5 -1.975,-0.645; 14 1.975,-0.645; 15 1.975,-0.215; 16 1.975,0.215; 17 1.975,0.645
2X3-NS = drill 1.016 pad 1.88 square: 1 -2.54,-1.27 | drill 1.016 pad 1.88 octagon: 2 -2.54,1.27; 3 0,-1.27; 4 0,1.27; 5 2.54,-1.27; 6 2.54,1.27
MALE_HEADER_2X1_0.1IN = drill 1.1 pad 1.65 square: 1 0,0 | drill 1.1 pad 1.65: 2 2.54,0
HDRV10W63P254_10X1_2540X254H838_HS = drill 1.1 pad 1.65 square: 1 0,0 | drill 1.1 pad 1.65: 2 2.54,0; 3 5.08,0; 4 7.62,0; 5 10.16,0; 6 12.7,0; 7 15.24,0; 8 17.78,0; 9 20.32,0; 10 22.86,0
FTDI_BASIC = drill 1.016 pad 1.88: CTS 10.16,0; DTR 0,0; GND 12.7,0; RXI 2.54,0; TXO 5.08,0; VCC 7.62,0
CUT_TAPE = smd 0.8 x 0.8: P$1 0,0; P$2 1.5,0
LEDSC125X200X120-2_HS = smd 0.94 x 0.99: A 1.045,0; C -1.045,0
MOTOR_PADS = smd 2 x 2: V+ -1,0; V- 2,0
N-CHANNEL_MOSFET = smd 2.05 x 2.9: DRAIN 2.025,0.95 | smd 1.5 x 1: GATE 0,1.9; SOURCE 0,0
RESC2012X60_HS = smd 0.92 x 1.38: 1 -0.955,0; 2 0.955,0
TE_FSM8JSMA_HS = smd 1.4 x 2.1: 1 -2.25,4.55; 2 -2.25,-4.55; 3 2.25,4.55; 4 2.25,-4.55
QFN-64 = smd 1.562 x 0.28: 1 -4.881,3.75; 2 -4.881,3.25; 3 -4.881,2.75; 4 -4.881,2.25; 5 -4.881,1.75; 6 -4.881,1.25; 7 -4.881,0.75; 8 -4.881,0.25; 9 -4.881,-0.25; 10 -4.881,-0.75; 11 -4.881,-1.25; 12 -4.881,-1.75; 13 -4.881,-2.25; 14 -4.881,-2.75; 15 -4.881,-3.25; 16 -4.881,-3.75; 33 4.881,-3.75; 34 4.881,-3.25; 35 4.881,-2.75; 36 4.881,-2.25; 37 4.881,-1.75; 38 4.881,-1.25; 39 4.881,-0.75; 40 4.881,-0.25; 41 4.881,0.25; 42 4.881,0.75; 43 4.881,1.25; 44 4.881,1.75; 45 4.881,2.25; 46 4.881,2.75; 47 4.881,3.25; 48 4.881,3.75 | smd 0.28 x 1.562: 17 -3.75,-4.881; 18 -3.25,-4.881; 19 -2.75,-4.881; 20 -2.25,-4.881; 21 -1.75,-4.881; 22 -1.25,-4.881; 23 -0.75,-4.881; 24 -0.25,-4.881; 25 0.25,-4.881; 26 0.75,-4.881; 27 1.25,-4.881; 28 1.75,-4.881; 29 2.25,-4.881; 30 2.75,-4.881; 31 3.25,-4.881; 32 3.75,-4.881; 49 3.75,4.881; 50 3.25,4.881; 51 2.75,4.881; 52 2.25,4.881; 53 1.75,4.881; 54 1.25,4.881; 55 0.75,4.881; 56 0.25,4.881; 57 -0.25,4.881; 58 -0.75,4.881; 59 -1.25,4.881; 60 -1.75,4.881; 61 -2.25,4.881; 62 -2.75,4.881; 63 -3.25,4.881; 64 -3.75,4.881
SOT23-DBV = smd 0.55 x 1.2: 1 -0.95,-1.3; 2 0,-1.3; 3 0.95,-1.3; 4 0.95,1.3; 5 -0.95,1.3
NET_BRIDGE = smd 2.54 x 2.54: P$1 0,0; P$2 2.54,0
CRYSTAL-SMD-5X3 = smd 1.9 x 1.1: 1 -1.85,-1.15; 2 1.85,-1.15; 3 1.85,1.15; 4 -1.85,1.15

### Placement (x,y rotation side)
A1  20.17,64.02 180 top
B1  27.39,64 0 top
BATT1  64,64 180 top
C1  40,105.36 45 top
C2  45.75,103.17 225 top
C3  89.41,103.01 135 top
C4  83.91,95.04 315 top
C5  89.7,25.49 225 top
C6  83.2,30.61 225 top
C7  39.42,24.63 315 top
C8  46.57,26.32 135 top
C9  36.95,73.36 90 top
C10  38.16,55.75 270 top
C11  50.62,60.69 0 top
C12  50.61,65.78 0 top
C13  39.33,76.75 180 top
C14  43.12,76.74 0 top
C15  28.07,60.82 270 top
C16  70.74,101.61 270 top
C17  25.55,60.84 90 top
C18  75.82,47.84 90 top
C19  86.56,47.18 270 top
C20  65.22,68.9 90 top
C21  62.74,68.97 270 top
C22  69.28,68.91 90 top
C23  67.27,68.92 90 top
C24  60.52,68.96 90 top
D1  49.07,109.21 45 top
D2  46.7,18.13 315 top
D3  82.12,108.83 135 top
D4  81.66,19.47 225 top
IMU1  64,64 0 top
J1  63.01,90.09 0 top
J2  65.14,43.56 270 top
J4  111.34,52.67 90 top
JP2  70.54,19.61 180 top
JP9  70.81,110.74 180 top
LED1  95,67 0 top
LED2  100,56.5 0 top
LED3  100,71.5 0 top
LED4  95,61 0 top
M1  31.83,96.61 225 top
M2  31.56,31.55 315 top
M3  95.59,95.93 315 top
M4  96.1,32.69 225 top
MOFSET1  39.54,35.63 135 top
MOFSET2  35.8,94.13 225 top
MOFSET3  95.93,87.74 315 top
MOFSET4  99.56,39.32 45 top
R1  48.74,100.04 225 top
R2  42.25,93.14 45 top
R3  52.25,28.81 225 top
R4  45.26,33.86 315 top
R5  82.31,101.06 315 top
R6  91.83,86.48 135 top
R7  90.04,37.32 225 top
R8  78.73,24.61 135 top
R9  74.85,93.08 0 top
R10  92,71.5 180 top
R11  92,56.5 180 top
R14  56.58,66.3 90 top
R15  56.59,60.84 270 top
SW1  80.45,83.93 180 top
U1  42.3,64 0 top
U$2  81.02,41.99 270 top
U$7  57.42,43.95 270 top
Y1  41.42,73.31 180 top

### Tracks (layer width: path | path; a pad name or v marks a point on that pad's centre or on a via)
AVDD
  Top 0.152: U1.60 40.55,70.67 40.06,71.16 38.25,71.16 C9.1
BAT_GND  (via drill 0.35, 0.38)
  Top 0.457: U$2.2 79.75,42 80.75,42 80.75,43.75 76,48.5 C18.2 75.75,48.75 67.75,48.75 67.75,50.75 67,51.5 64,51.5 BATT1.- | v40.25,23.75 41.5,22.5 C7.2 | v86,22 87.25,23.25 C5.2 | v40.75,106.25 42,107.5 C1.2 | v85.75,106.5 87,105.25 C3.2 | v55.25,41.5 57.25,41.5 U$7.P$2 | MOFSET1.SOURCE 39.54,36.03 v41.26,37.74 | MOFSET2.SOURCE 35.8,94.66 v37.55,96.41 | MOFSET4.SOURCE 94.92,39.32 v94.69,39.09 | MOFSET3.SOURCE 95.77,87.74 94.35,86.32 94.35,85.41 v94.55,85.22
  Bottom 0.457: v55.25,41.5 56.25,41.5 64,49.25 BATT1.-
  pour Route15: 37.86,41.86 27.23,32.1 44.73,14.93 84.27,15.26 113.18,44.16 113.18,84.1 83.95,113.33 44.25,113.29 24.93,94.32 35.04,83.72 49.56,98.81 77.77,98.81 77.92,98.66 104.3,71.72 104.31,70.42 104.35,52.81 75.39,27.27 75.29,27.38 68.11,27.38 68.3,41.61
DTR
  Top 0.152: C16.1 70.75,102.75 70.75,110.5 JP9.DTR
DVDD
  Top 0.152: C10.1 38.19,56.67 39.15,56.67 40.55,58.07 U1.21 U1.22
FILTERED_1  (via drill 0.38)
  Top 0.457: 47.25,28 51.5,28 R3.2 | 47.25,28 47.25,25.75 C8.1 | 47.25,28 47.25,31.75 46,33 R4.2 45.75,33.25 v44.75,32.25 | v40.25,34.25 38.25,34.25 MOFSET1.GATE
  Bottom 0.457: v40.25,34.25 42.25,32.25 v44.75,32.25
FILTERED_2  (via drill 0.38)
  Top 0.457: R1.2 48,99.5 46.5,101 46.5,103.75 C2.1 46.25,103.75 44.75,103.75 43.75,102.75 43.75,94.75 43,94 R2.2 42.75,93.75 v40.75,93.75 | v39,93 37.25,93 MOFSET2.GATE
  Bottom 0.457: v39,93 39.75,93.75 v40.75,93.75
FILTERED_3
  Top 0.457: R5.2 83,100.25 83.25,100 83.25,95.75 C4.1 83.5,95.75 91.25,95.75 91.25,87.5 R6.2 91.25,87.25 94.5,90.5 97.25,90.5 97.25,89.25 MOFSET3.GATE
FILTERED_4
  Top 0.457: R8.2 78.25,25.25 78.25,23.5 79,22.75 83.75,22.75 83.75,31 C6.1 84,31.25 89.25,36.5 R7.2 89.5,36.75 89.5,40.5 98,40.5 MOFSET4.GATE
FLYBACK_1
  Top 0.457: 36.62,29.88 36.5,30 33,30 M2.V- | 36.62,29.88 43.75,22.75 43.75,17 47.75,17 D2.A | MOFSET1.DRAIN 37.25,36.25 36.75,35.75 36.75,30 36.62,29.88
FLYBACK_2
  Top 0.457: 30.5,96.75 30.5,95.25 M1.V- | 30.5,96.75 30.5,98.25 41.25,109 41.25,110.25 50,110.25 D1.A | 30.5,96.75 35,92.25 MOFSET2.DRAIN
FLYBACK_3
  Top 0.457: D3.A 81,110 82.25,108.75 82.25,106.75 94.25,94.75 97,94.75 M3.V- 97.25,94.5 98.75,93 98.75,87.5 98.25,87 MOFSET3.DRAIN
FLYBACK_4  (via drill 0.38)
  Top 0.457: 97.12,35.12 97,35.25 94.75,35.25 94.75,31.5 M4.V- | 97.12,35.12 98.75,33.5 98.75,32.25 87.5,21 87.5,18.5 80.5,18.5 D4.A | v101,39 101,40.75 100.5,41.25 MOFSET4.DRAIN | 97.12,35.12 v98.75,36.75
  Bottom 0.457: v98.75,36.75 v101,39
GND  (via drill 0.35, 0.38)
  Top 0.152: IMU1.20 IMU1.19 IMU1.18 65.53,65.72 65.53,67.13 67.22,67.13 | IMU1.14 IMU1.15 IMU1.16 IMU1.17 67.22,64.64 | 67.22,67.07 67.22,64.64 | v68.2,64.66 68.2,64.64 67.22,64.64 | 67.22,67.13 67.22,68.02 C23.1 67.25,67.75 | C22.1 69.27,67.07 67.22,67.07 | 67.22,67.07 67.22,67.13 | IMU1.6 62.49,60.43 v62.05,59.98 62,59.75 62,48.5 59,45.5 | 96.5,61.75 LED4.P$2 98.12,61 v98.4,60.73 98.95,60.17 LED2.C | 96.5,61.75 LED1.P$2 93.75,69.75 92.25,69.75 92.25,77.5 | 96.5,61.75 112,61.75 112.5,62.25 112.5,74.5 111.5,75.5 J4.10 | R8.1 79.5,24 82.5,27 82.5,29.75 C6.2 82.56,38.06 89.27,44.77 89.27,47.34 v88.67,47.93 88.53,48.08 C19.1 | 41.5,77.75 38.5,77.75 38.5,77 C13.2 38.25,76.75 38.25,75.75 37,74.5 C9.2 36.75,74.25 36,73.5 36,71.75 37.75,70 40,70 40,69 U1.61 40,68.75 40,65 | 41.5,77.75 43,77.75 44,76.75 C14.2 | R2.1 41.75,92.5 45,92.5 45,102.5 C2.2 | 41.5,92.5 R2.1 | 41.5,77.75 v41.5,85 41.5,92.25 R2.1 | 47.25,59.25 47.25,60.25 U1.33 | 47.25,59.25 47.25,58.25 50,58.25 50.75,59 50.75,59.75 51.5,60.5 C11.2 | 46,61.25 U1.35 | 46,61.25 46,60.5 47.25,59.25 | C12.2 51.5,66 50.75,66.75 50.75,67.5 50,68.25 48.75,68.25 48.75,66.75 48.25,66.25 U1.45 43,66.25 43,67.75 | 43,67.75 42,67.75 | 42,67.75 41.75,67.75 41.5,68 41.5,68.75 U1.58 | 43,67.75 43,68.75 U1.55 | 37.5,63.25 37.5,62.75 U1.11 37.29,62.62 36.54,62.62 36.35,62.42 v31.27,62.42 | 40,64.75 38.5,64.75 | 38.5,64.75 U1.7 | 40,65 40,64.75 | 42,60.25 42,62.75 41.5,63.25 | 42,60.25 42,59.25 U1.24 | 40,64.75 41.5,63.25 | 37.5,63.25 38.5,63.25 38.5,64.75 | 37.5,63.25 U1.10 | 42,67.75 42,67 40,65 | 46,61.25 44,61.25 44,62.5 43.25,63.25 41.5,63.25 | C10.2 38,55 37,56 37,57 38,58 40,58 40,59 U1.20 40,59.25 40,60.25 42,60.25
  Top 0.152: 38.25,54.75 C10.2 | 92.75,77.5 98.75,71.5 LED3.C | 92.75,84.25 92.75,85.75 R6.1 | 92.75,84.25 92.75,77.5 | 92.75,84.25 90,87 90,89 84.75,94.25 C4.2 | C8.2 45.75,27 43.75,29 43.75,33.75 44.5,34.5 R4.1 44.75,34.75 v44.75,44 | 62,70 62.5,70 C21.1 | 62,70 60.75,70 C24.2 | 67.25,67.75 65.25,69.75 C20.2 | SW1.4 78.25,88.25 78.25,79.5 SW1.3 78,79.25 78,77.5 | 67.25,67.75 69,67.75 69,68.25 69.75,69 78,69 78,77.5 | 62,70 62,83.25 64.25,85.5 64.25,90 65.5,91.25 J1.6 | 59,45.5 57.5,44 U$7.P$1 | 59,45.5 59,20.75 58,19.75 JP2.GND | 78,77.5 92.25,77.5 | 92.25,77.5 92.75,77.5 | B1.5 27.39,66.68 v27.94,67.23 | C15.2 28.07,58.13 v28.03,58.09 | C17.1 25.55,58.54 v26,58.09 | C10.2 39.26,54.85 v40.34,53.78
  Route15 0.152: v44.75,44 44.75,44.06
  Bottom 0.152: JP9.GND 58.25,110.5 65.5,103.25 65.5,91.5 J1.6
  other vias: 29.92,67.19 25.98,67.25 23.95,67.26 31.15,65.41 31.21,60.2 30.42,58.2 23.92,58.03
  pour Route15: 34.65,82.29 50.99,97.79 76.59,97.6 103.29,70.52 103.1,53.12 74.7,28.08 69.15,27.97 69.25,42.27 60.07,42.42 60.07,43.73 34.94,44.27
  pour Route2: 32.43,68.43 32.31,56.86 22.62,56.91 22.69,68.47
  pour Top: 22.78,68.45 32.46,68.43 32.32,56.9 22.66,56.92
MISO  (via drill 0.38)
  Top 0.152: v48.75,63.25 U1.39 | v53,65.75 53,81.5 60.25,88.75 J1.1
  Bottom 0.152: v48.75,63.25 51.25,65.75 v53,65.75
MOSI  (via drill 0.38)
  Top 0.152: U1.38 45.5,62.75 v45.5,63.25 | v54,68.25 54.25,68.5 54.25,80.25 61.75,87.75 61.75,90 63,91.25 J1.4
  Bottom 0.152: v45.5,63.25 48.5,66.25 52,66.25 v54,68.25
N$1
  Top 0.152: IMU1.21 64.22,67 C20.1
N$2
  Top 0.152: IMU1.24 62.92,67.89 C21.2
N$3
  cutout Route2: 60.89,66.9 67.03,66.9 67.03,61.15 60.9,61.15 60.89,61.15 60.89,66.89
N$4
  Top 0.152: JP2.RXI 68,21 65,21 64.25,20.25 64.25,18.25 57.5,18.25 56.5,19.25 56.5,24.25 51.75,29 51.75,49.75 44,57.5 44,59 U1.28
N$5
  Top 0.152: U1.27 43.5,59 43.5,57.5 43.75,57.25 43.75,34.75 43.25,34.25 43.25,28.25 53.75,17.75 65.25,17.75 65.25,19.5 JP2.TXO
N$7
  Top 0.457: BATT1.+ 66.5,49.25 65.25,48 65.25,43.75 J2.1
N$13
  Top 0.152: U1.57 42.05,69.67 41.52,70.21 | 41.52,70.21 Y1.3 | 41.52,70.21 41.52,75.45 C13.1
N$14
  Top 0.152: U1.56 42.55,71.05 42.09,71.51 42.09,73.2 42.09,73.28 | 42.09,73.28 Y1.1 | 42.09,73.28 42.09,76.6 C14.1
N$15
  Top 0.152: B1.2 27.39,62.4 C15.1
N$16
  Top 0.152: LED3.A 101,71.5 99.75,70.25 93,70.25 93,71.5 R10.1
N$17
  Top 0.152: LED2.A 101,56.5 99.75,55.25 93,55.25 93,56.5 R11.1
N$18
  Top 0.152: U1.8 28.59,64.25 B1.4
N$19
  Top 0.152: U1.9 28.59,63.75 B1.3
PB5  (via drill 0.38)
  Top 0.152: 52.5,59 52.5,61.25 49.5,64.25 U1.41 | 52.5,59 52.5,29.75 52.75,29.5 R3.1 | 52.5,59 v53,59
  Bottom 0.152: v53,59 65.75,59 66.25,59.5 109.5,59.5 111.25,57.75 J4.3
PB6  (via drill 0.38)
  Top 0.152: v88.75,69.25 91,71.5 R10.2 | v53.75,64.5 49.75,64.5 49.5,64.75 U1.42
  Bottom 0.152: v88.75,69.25 86.75,67.25 56.5,67.25 v53.75,64.5
PB7  (via drill 0.38)
  Top 0.152: v90.75,58.5 90.75,56.75 91,56.5 R11.2 | v42,64.25 43.5,65.75 46,65.75 46,65.5 46.25,65.25 U1.43
  Bottom 0.152: v90.75,58.5 53.75,58.5 53.25,58 46,58 42,62 v42,64.25
PE3  (via drill 0.38)
  Top 0.152: U1.49 46.05,70.75 | 46.05,70.75 46.05,70.83 | R7.1 90.75,37.75 100.5,37.75 100.75,37.5 106.75,37.5 106.75,55.75 111.25,60.25 J4.4 | 46.05,70.75 48.25,70.75 v48.25,71.25 | 46,70.75 46.05,70.75
  Bottom 0.152: v48.25,71.25 49.75,72.75 97.25,72.75 103.5,66.5 111.75,66.5 112.5,65.75 112.5,60.5 111.5,60.5 J4.4
PE4  (via drill 0.38)
  Top 0.152: U1.50 45.53,68.88 45.53,70.75 | 45.53,70.75 45.53,70.83 | R5.1 81.5,101.75 80,103.25 80,110.5 80.5,111 86.25,111 86.25,108.25 110.25,84.25 110.25,64 111.25,63 J4.5 | v46.5,71.75 45.5,70.75 45.53,70.75
  Bottom 0.152: v46.5,71.75 48,70.25 92.25,70.25 99.5,63 111.25,63 J4.5
PE5  (via drill 0.38)
  Top 0.152: U1.51 45.05,70.75 | 45.05,70.75 45.05,70.89 | 48.25,74.75 45,71.5 45,70.75 45.05,70.75 | 48.25,74.75 49.25,75.75 49.25,100.5 R1.1 | 48.25,74.75 v51.5,71.5
  Bottom 0.152: v51.5,71.5 52.25,70.75 92.25,70.75 97,66 110.75,66 111.25,65.5 J4.6
PG0  (via drill 0.38)
  Top 0.152: LED4.P$1 92,58 v92,55.25 | v36.5,55 35.75,55.75 35.75,60.5 36.5,61.25 U1.14
  Bottom 0.152: v92,55.25 91.75,55 v36.5,55
PG1  (via drill 0.38)
  Top 0.152: v84.5,56.5 LED1.P$1 | U1.15 v39,60.75
  Bottom 0.152: v84.5,56.5 84,56 41.75,56 39,58.75 v39,60.75
RESET  (via drill 0.35)
  Top 0.152: U1.12 39.26,62.25 v39.27,62.26 | SW1.1 82.75,79.5 82.75,88.25 SW1.2 82.5,88.5 77,94 74,94 74,93.25 R9.1 73.75,93.25 71.75,95.25 | 71.75,95.25 70.75,96.25 70.75,100.5 C16.2 | 71.75,95.25 71.75,95 65.75,89 J1.5
  Bottom 0.152: v39.27,62.26 39.27,67.08 35.27,71.07 35.27,81.21 v35.76,81.7 36,81.75 41.75,87.5 64.25,87.5 65.5,88.75 J1.5
RFANT
  Top 0.457: 25.77,63.2 B1.1 | 25.77,63.2 24.28,63.2 A1.FEED | C17.2 25.55,62.98 25.77,63.2
RX0
  Top 0.152: U1.46 48.25,66.75 48.25,68.25 50.5,70.5 52.5,70.5 52.5,97.5 65.5,110.5 JP9.TXO
SCK  (via drill 0.38)
  Top 0.152: U1.37 44.5,62.25 v44.5,64.25 | v55.5,77.25 63,84.75 63,88.75 J1.3
  Bottom 0.152: v44.5,64.25 44.5,77.25 v55.5,77.25
SCL  (via drill 0.38)
  Top 0.152: IMU1.2 57.27,64.64 R14.1 56.5,65.25 54,62.75 54,57.5 v53.5,57 | v42.75,57 42.5,57.25 42.5,59 U1.25
  Bottom 0.152: v42.75,57 v53.5,57 54,56.5 55.5,56.5 56.5,57.5 90,57.5 90.5,57 107,57 111.25,52.75 J4.1
SDA  (via drill 0.38)
  Top 0.152: IMU1.4 58.59,63.78 R15.1 56.5,62 56.5,62.25 55.25,62.25 | v43,62.25 43,59.25 U1.26 | 55.25,62.25 v55.25,57.5 | 55.25,62.25 v55,62.25
  Bottom 0.152: v55,62.25 v43,62.25 | v55.25,57.5 55.75,58 90,58 90.5,57.5 109,57.5 111.25,55.25 J4.2
TX0  (via drill 0.38)
  Top 0.152: v45.5,67.25 U1.47
  Bottom 0.152: v45.5,67.25 45.5,74.75 57,74.75 70.5,88.25 70.5,109.5 69.5,109.5 68.5,110.5 JP9.RXI
VBAT  (via drill 0.38)
  Top 0.457: M4.V+ 96.75,33.25 96.5,33 96.5,31 93.25,27.75 92,27.75 C5.1 91.75,27.5 89.25,27.5 85.5,23.75 85.5,23.25 83,20.75 D4.C 82.75,20.75 76.75,20.75 76.75,41.25 | D1.C 47.75,108 v45.5,105.75 43,103.25 38,103.25 C1.1 37.75,103 37.75,102.5 32.75,97.5 M1.V+ | 84.38,106.62 84.75,106.25 84.75,105.25 89,101 91.5,101 C3.1 91.75,100.75 91.75,99.75 94.75,96.75 M3.V+ | 84.38,106.62 83.5,107.5 D3.C | 76,41.25 76.75,41.25 | 76.75,41.25 78.5,41.25 | 78.5,41.25 79.5,41.25 U$2.3 | 76,41.25 76,46.75 C18.1 | 78.5,41.25 78.5,42.75 79.5,42.75 U$2.1 | D2.C 45.75,19.5 46.25,20 v46.25,20.25 46.25,19.75 49,17 49,16.5 48.25,15.75 43.25,15.75 43.25,16.5 37.25,22.5 37.25,23.75 | 37.25,23.75 37.25,26.75 C7.1 | 37.25,23.75 31,30 31,32.25 M2.V+ | 76,41.25 65.25,41.25 J2.2 | v84.25,106.5 84.38,106.62
  pour Route2: 37.86,41.89 62.4,41.67 62.41,41.68 68.3,41.68 68.12,27.38 75.37,27.29 104.44,52.73 104.31,71.77 77.71,98.85 49.54,98.91 35.02,83.65 24.89,94.19 44.26,113.32 83.75,113.35 113.18,83.92 113.12,44.19 84.25,15.27 82.67,15.23 44.71,15.02 27.22,32.1
VCC  (via drill 0.35, 0.38)
  Top 0.152: IMU1.1 62.49,67.16 62.49,67.17 61.42,67.17 | 61.42,67.17 C24.1 | IMU1.23 IMU1.22 63.78,70.8 v62.87,71.72 65.36,71.72 | 65.36,71.72 C23.2 | 65.36,71.72 67.37,71.72 C22.2 69.5,70 69.5,86.75 75.75,93 R9.2 | IMU1.7 IMU1.8 63.35,60.88 65.51,60.88 | IMU1.13 65.51,60.88 | 61.42,67.17 59.39,67.17 v58.48,68.07 57.67,67.25 R14.2 | U1.44 47.21,65.78 C12.1 49.75,66 v49.75,67.25 | U1.34 47.24,60.69 C11.1 49.75,60.5 v49.75,59.25 | R15.2 56.59,60.05 v59.09,62.55 59.9,63.35 IMU1.5 | IMU1.3 56.61,64.22 v55.95,63.56 | v65.48,60.04 65.51,60.07 65.51,60.88 | U$2.5 82.5,43 v84.5,43 86.5,43 86.5,46.25 C19.2 | v41,67.25 41,68.75 U1.59 | v41.5,57.5 41.5,59 U1.23 | v43.5,70.5 43.5,69 U1.54
  Bottom 0.152: v103.25,68 111.25,68 J4.7
  pour Route2: 103.36,70.48 76.68,97.55 50.99,97.91 34.55,82.23 34.95,44.25 60.07,43.81 60.07,42.36 61.64,42.36 69.19,42.24 69.08,27.98 74.6,28.02 103.12,53.1 103.12,53.11

### Text on the board
tPlace: GND | CTS | VCC | TXO | RXI | DTR | GND | BAT_GND | VBAT | VCC | PE5 | PE4 | PE3 | PB5 | SDA | SCL | DTR | RXI | TXO | VCC | CTS | GND